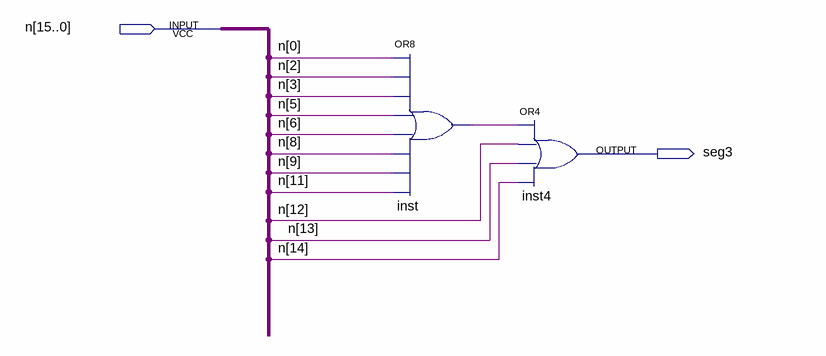
[diagram p0: schematic sheet]
// Quartus schematic seg3.bdf as structural Verilog: 2 symbols, 2 pins
module seg3 (
  input  [15:0] n,
  output seg3
);

  wire inst_out;

  or inst (inst_out, n[0], n[2], n[3], n[5], n[6], n[8], n[9], n[11]);
  or inst4 (seg3, inst_out, n[12], n[13], n[14]);
endmodule
